# EasyEDA Pro project Charger.epro

# Schematic Schematic1
Board Name: Board1; Create Date: 2025-06-16; Page Name: P1; Project Name: SlimeVR / Charger; Schematic Name: Schematic1; Update Date: 2025-06-16; Company: EasyEDA.com; Page Size: A4; Version: V1.0
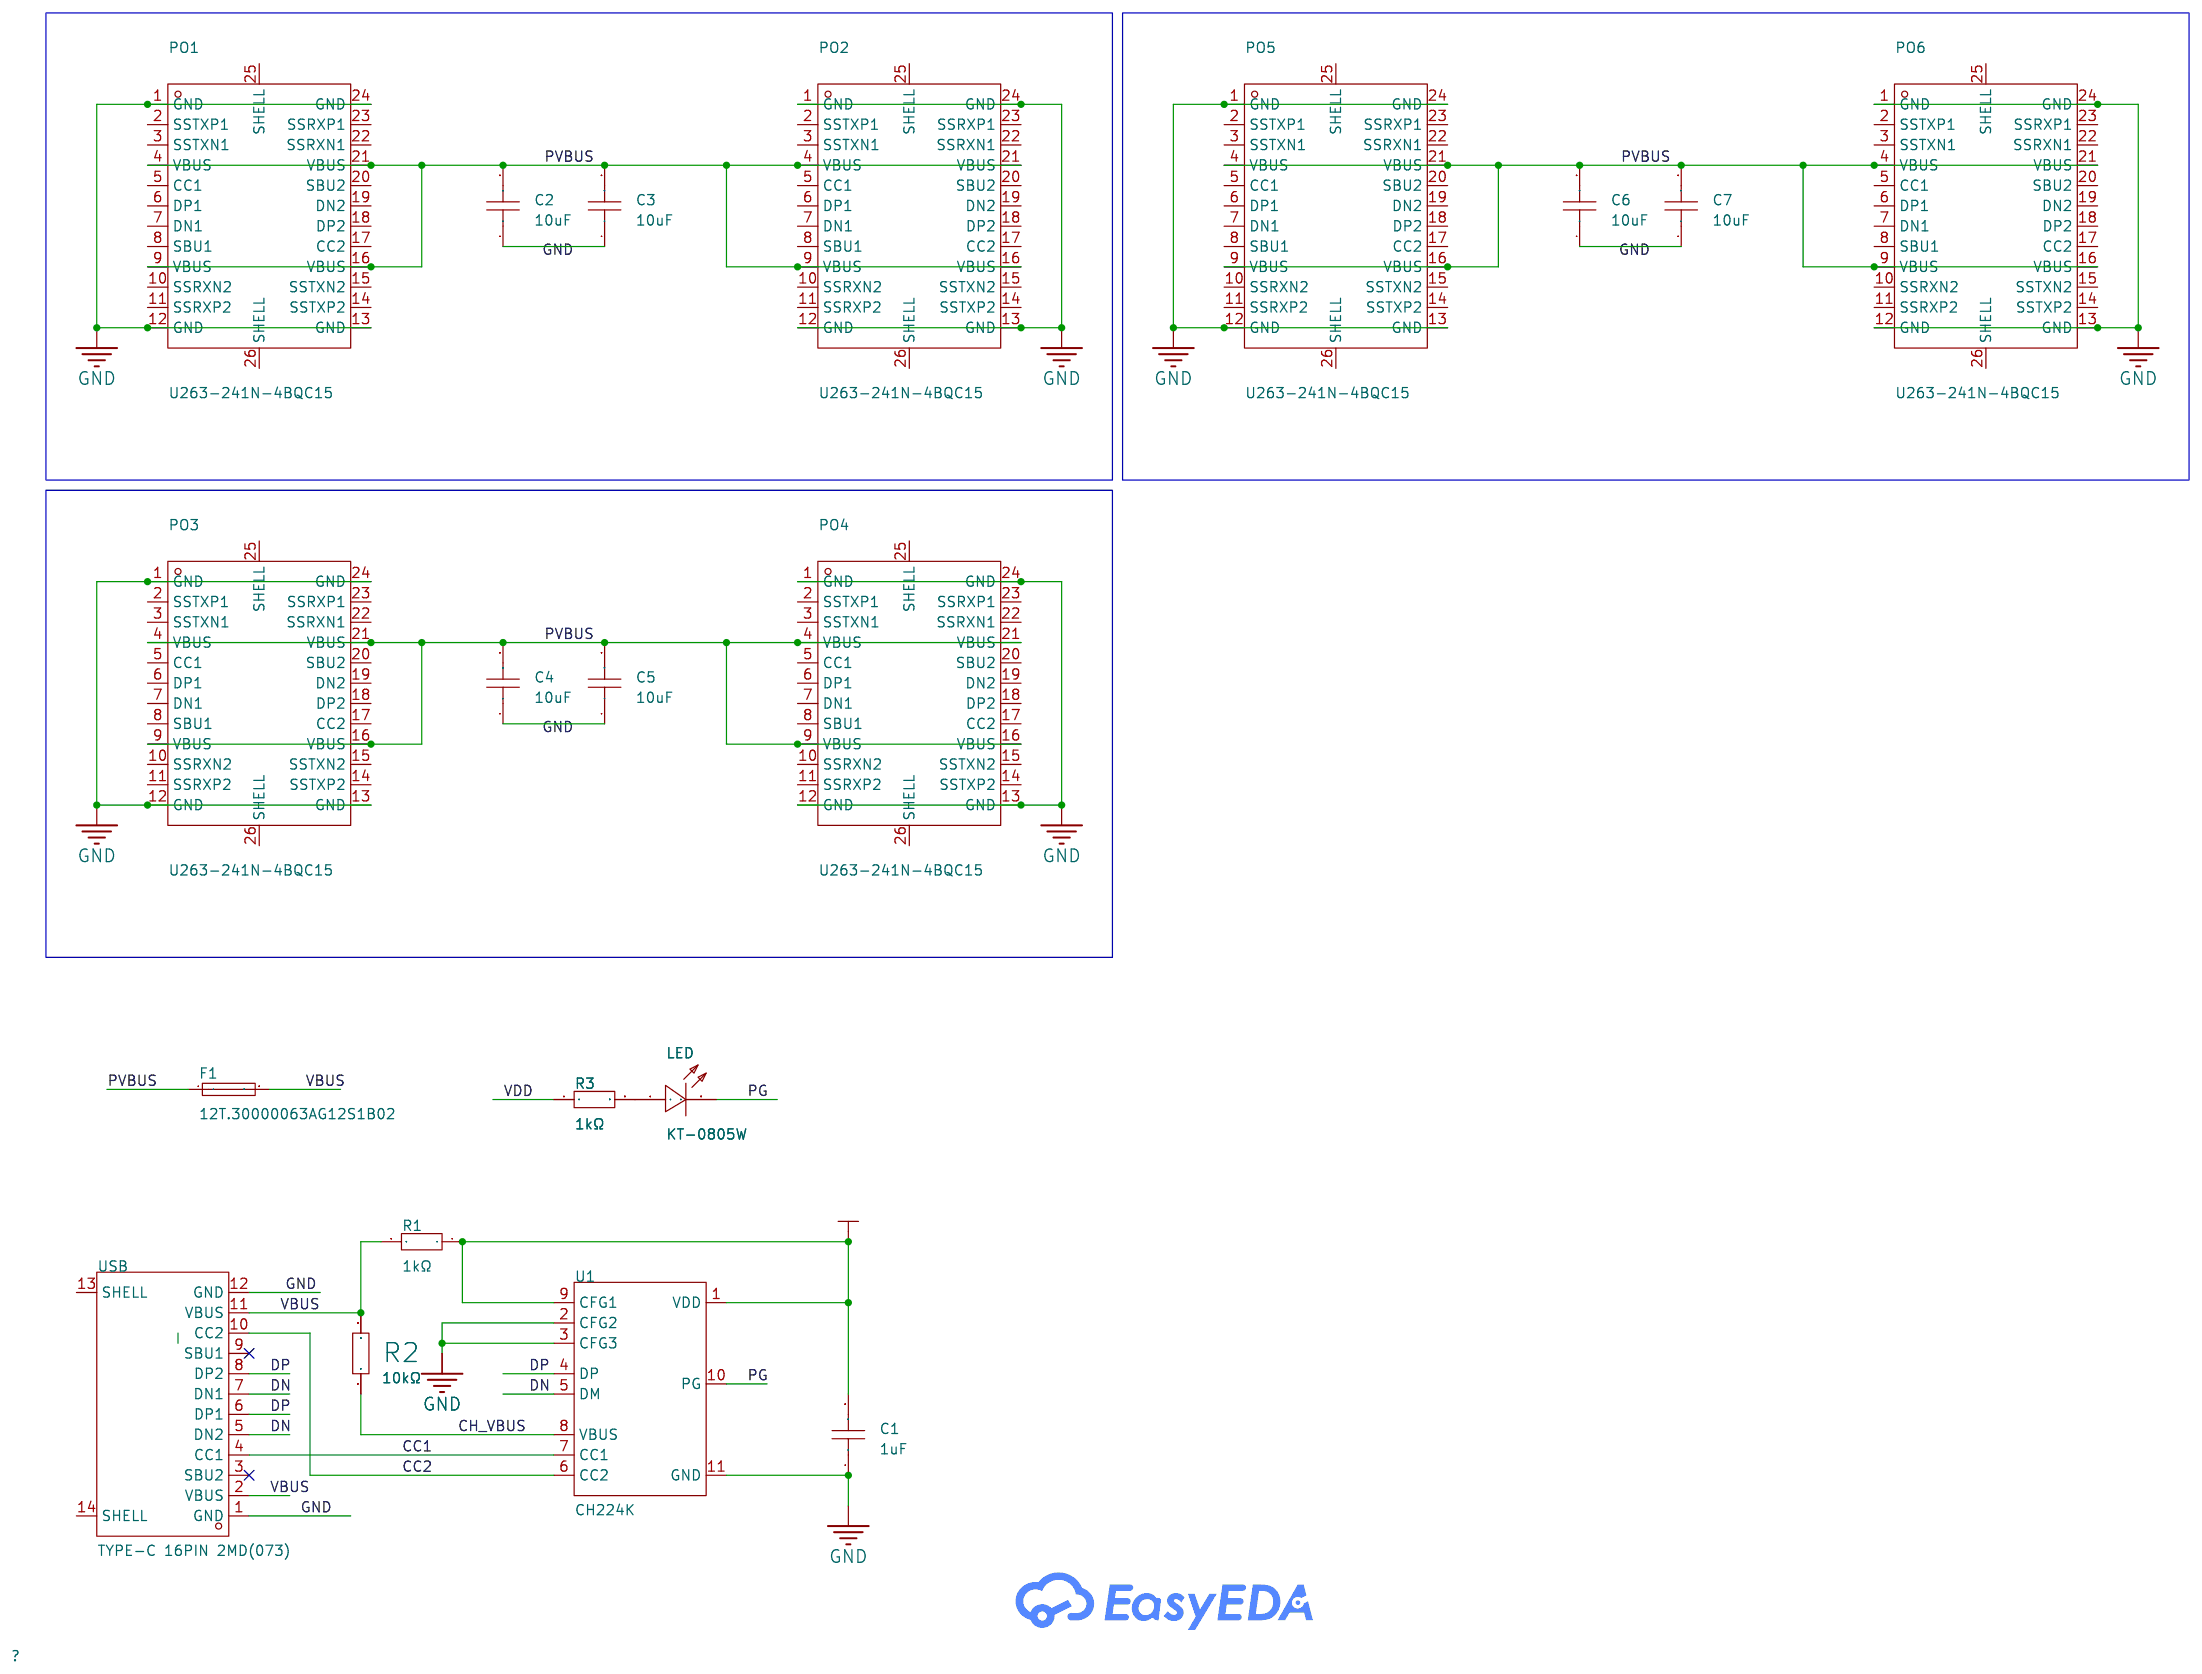
[diagram p0: schematic sheet]

## Parts
C1  1uF  [C0603]
C2  10uF  [C0805]
C3  10uF  [C0805]
C4  10uF  [C0805]
C5  10uF  [C0805]
C6  10uF  [C0805]
C7  10uF  [C0805]
F1  12T.30000063AG12S1B02  [F1206]
LED  KT-0805W  [LED0805-R-RD]
PO1  U263-241N-4BQC15  [USB-C-SMD_U263-241N-4BQC15]
PO2  U263-241N-4BQC15  [USB-C-SMD_U263-241N-4BQC15]
PO3  U263-241N-4BQC15  [USB-C-SMD_U263-241N-4BQC15]
PO4  U263-241N-4BQC15  [USB-C-SMD_U263-241N-4BQC15]
PO5  U263-241N-4BQC15  [USB-C-SMD_U263-241N-4BQC15]
PO6  U263-241N-4BQC15  [USB-C-SMD_U263-241N-4BQC15]
R1  1kΩ  [R0603]
R2  10kΩ  [R0603]
R3  1kΩ  [R0603]
U1  CH224K  [ESSOP-10_L4.9-W3.9-P1.0-LS6.0-TL-EP]
USB  TYPE-C 16PIN 2MD(073)  [USB-C-SMD_TYPE-C-6PIN-2MD-073]

## Library data of the parts
C1 = CL10A105KB8NNNC: Capacitance: Tolerance:±10% Tolerance:±10% Voltage Rated: Temperature Coefficient:; LCSC Part Name: 1uF ±10% 50V; Supplier Part: C15849; Manufacturer: SAMSUNG(三星); Supplier Footprint: 0603; JLCPCB Part Class: Basic Part; Datasheet: https://atta.szlcsc.com/upload/public/pdf/source/20160218/1457707763339.pdf; Supplier: LCSC; Tolerance: ±10%
C2-C7 = CL21A106KAYNNNE_C15850: Capacitance: Tolerance:±10% Tolerance:±10% Voltage Rated: Temperature Coefficient:; LCSC Part Name: 10uF ±10% 25V; Supplier Part: C15850; Manufacturer: SAMSUNG(三星); Manufacturer Part: CL21A106KAYNNNE; Supplier Footprint: 0805; JLCPCB Part Class: Basic Part; Datasheet: https://atta.szlcsc.com/upload/public/pdf/source/20160218/1457707763339.pdf; Supplier: LCSC; Tolerance: ±10%
F1 = 12T.30000063AG12S1B02: Type:SMD Fuse Current Rating:3A Voltage Rating (DC):63V Operating Temperature:-55℃~+125℃ Operating Temperature:-55℃~+125℃ Interrupt Rating:50A; LCSC Part Name: 贴片式保险丝; Supplier Part: C140478; Manufacturer: xcfuse(旭程); Supplier Footprint: 1206; JLCPCB Part Class: Extended Part; Datasheet: https://atta.szlcsc.com/upload/public/pdf/source/20180423/C140482_0BFCB1E2582598C0CD6C9793BBCA88DB.pdf; Supplier: LCSC; Type: SMD Fuse; Current Rating: 3A; Voltage Rating (DC): 63V; Operating Temperature: -55℃~+125℃; Interrupt Rating: 50A
LED = KT-0805W: LCSC Part Name: 0805 白灯 高亮; Supplier Part: C34499; Manufacturer: KENTO; Supplier Footprint: 0805; JLCPCB Part Class: Basic Part; Datasheet: https://atta.szlcsc.com/upload/public/pdf/source/20221124/DAA20402FFC1FB071B8B6797757426FE.pdf; Supplier: LCSC
PO1-PO6 = U263-241N-4BQC15: Connector Type:Type-C Standard:- Gender:Male Mounting Style:- Number of Contacts:24P Number of Ports:1 Current Rating - Power (Max):3A Contact Material:Copper alloy Contact Plating:Gold Operating Temperature Range:-30℃~+85℃ Operating Temperature Range:-30; LCSC Part Name: Type-C 公; Supplier Part: C2764604; Manufacturer: XKB Connection(中国星坤); Supplier Footprint: SMD; JLCPCB Part Class: Extended Part; Datasheet: https://atta.szlcsc.com/upload/public/pdf/source/20211011/8F46773D4A429D5B7D6EF8AD2F8FE85B.pdf; Supplier: LCSC; Connector Type: Type-C; Gender: Male; Number of Contacts: 24P; Number of Ports: 1; Current Rating - Power (Max): 3A; Contact Material: Copper alloy; Contact Plating: Gold; Operating Temperature Range: -30℃~+85℃; Soldering Temperature(Max): 260℃
R1 R3 = 0603WAF1001T5E: Type:Thick Film Resistors Resistance:1kΩ Tolerance:±1% Tolerance:±1% Power(Watts): Overload Voltage (Max): Temperature Coefficient:±100ppm/℃ Temperature Coefficient:±100ppm/℃ Operating Temperature Range:-55℃~+155℃ Operating Temperature Range:-55℃~+155℃; LCSC Part Name: 1kΩ ±1% 100mW 厚膜电阻; Supplier Part: C21190; Manufacturer: UNI-ROYAL(厚声); Supplier Footprint: 0603; JLCPCB Part Class: Basic Part; Datasheet: https://atta.szlcsc.com/upload/public/pdf/source/20200306/C422600_1E6D84923E4A46A82E41ADD87F860B5C.pdf; Supplier: LCSC; Type: Thick Film Resistors; Tolerance: ±1%; Temperature Coefficient: ±100ppm/℃; Operating Temperature Range: -55℃~+155℃
R2 = 0603WAF1002T5E: Type:Thick Film Resistors Resistance:10kΩ Tolerance:±1% Tolerance:±1% Power(Watts): Overload Voltage (Max): Temperature Coefficient:±100ppm/℃ Temperature Coefficient:±100ppm/℃ Operating Temperature Range:-55℃~+155℃ Operating Temperature Range:-55℃~+155℃; LCSC Part Name: 厚膜电阻 10kΩ ±1% 100mW; Supplier Part: C25804; Manufacturer: UNI-ROYAL(厚声); Supplier Footprint: 0603; JLCPCB Part Class: Basic Part; Datasheet: https://atta.szlcsc.com/upload/public/pdf/source/20200306/C422600_1E6D84923E4A46A82E41ADD87F860B5C.pdf; Supplier: LCSC; Type: Thick Film Resistors; Tolerance: ±1%; Temperature Coefficient: ±100ppm/℃; Operating Temperature Range: -55℃~+155℃
U1 = CH224K: LCSC Part Name: USBPD等多快充协议受电芯片CH224; Supplier Part: C970725; Manufacturer: WCH(南京沁恒); Supplier Footprint: ESSOP-10-150mil-1mm; JLCPCB Part Class: Extended Part; Datasheet: https://atta.szlcsc.com/upload/public/pdf/source/20240313/43C2AFDDBDD1F65B60386D2CCAB0811B.pdf; Supplier: LCSC
USB = TYPE-C 16PIN 2MD(073): Connector Type:Type-C Standard:USB 3.1 Gender:Female Mounting Style:Horizontal attachment Number of Contacts:16P Number of Ports:1 Current Rating - Power (Max):5A Operating Temperature Range:-25℃~+85℃ Operating Temperature Range:-25℃~+85℃ Rated Voltage (M; LCSC Part Name: Type-C 母 卧贴; Supplier Part: C2765186; Manufacturer: SHOU HAN(首韩); Supplier Footprint: SMD; JLCPCB Part Class: Extended Part; Datasheet: https://atta.szlcsc.com/upload/public/pdf/source/20211123/39B17C16241EAC15C5E277BDA434118E.pdf; Supplier: LCSC; Connector Type: Type-C; Standard: USB 3.1; Gender: Female; Mounting Style: Horizontal attachment; Number of Contacts: 16P; Number of Ports: 1; Current Rating - Power (Max): 5A; Operating Temperature Range: -25℃~+85℃; Rated Voltage (Max): 5V; Connect-Disconnect Life: 5000 Cuts; Core Colour: Black

## Nets
GND: C1.1 C2.1 C3.1 C4.1 C5.1 C6.1 C7.1 PO1.1(GND) PO1.12(GND) PO1.13(GND) PO1.24(GND) PO2.1(GND) PO2.12(GND) PO2.13(GND) PO2.24(GND) PO3.1(GND) PO3.12(GND) PO3.13(GND) PO3.24(GND) PO4.1(GND) PO4.12(GND) PO4.13(GND) PO4.24(GND) PO5.1(GND) PO5.12(GND) PO5.13(GND) PO5.24(GND) PO6.1(GND) PO6.12(GND) PO6.13(GND) PO6.24(GND) U1.2(CFG2) U1.3(CFG3) U1.11(GND) USB.1(GND) USB.12(GND)
PVBUS: C2.2 C3.2 C4.2 C5.2 C6.2 C7.2 F1.1 PO1.4(VBUS) PO1.9(VBUS) PO1.16(VBUS) PO1.21(VBUS) PO2.4(VBUS) PO2.9(VBUS) PO2.16(VBUS) PO2.21(VBUS) PO3.4(VBUS) PO3.9(VBUS) PO3.16(VBUS) PO3.21(VBUS) PO4.4(VBUS) PO4.9(VBUS) PO4.16(VBUS) PO4.21(VBUS) PO5.4(VBUS) PO5.9(VBUS) PO5.16(VBUS) PO5.21(VBUS) PO6.4(VBUS) PO6.9(VBUS) PO6.16(VBUS) PO6.21(VBUS)
VBUS: F1.2 R1.2 R2.2 USB.2(VBUS) USB.11(VBUS)
VDD: C1.2 R1.1 R3.1 U1.1(VDD) U1.9(CFG1)
CC1: U1.7(CC1) USB.4(CC1)
CC2: U1.6(CC2) USB.10(CC2)
CH_VBUS: R2.1 U1.8(VBUS)
DN: U1.5(DM) USB.5(DN2) USB.7(DN1)
DP: U1.4(DP) USB.6(DP1) USB.8(DP2)
PG: LED.2(K) U1.10(PG)
$1N1647: LED.1(A) R3.2

Not connected (* = marked no-connect by the designer): PO1 2(SSTXP1) 3(SSTXN1) 5(CC1) 6(DP1) 7(DN1) 8(SBU1) 10(SSRXN2) 11(SSRXP2) 14(SSTXP2) 15(SSTXN2) 17(CC2) 18(DP2) 19(DN2) 20(SBU2) 22(SSRXN1) 23(SSRXP1) 25(SHELL) 26(SHELL); PO2 2(SSTXP1) 3(SSTXN1) 5(CC1) 6(DP1) 7(DN1) 8(SBU1) 10(SSRXN2) 11(SSRXP2) 14(SSTXP2) 15(SSTXN2) 17(CC2) 18(DP2) 19(DN2) 20(SBU2) 22(SSRXN1) 23(SSRXP1) 25(SHELL) 26(SHELL); PO3 2(SSTXP1) 3(SSTXN1) 5(CC1) 6(DP1) 7(DN1) 8(SBU1) 10(SSRXN2) 11(SSRXP2) 14(SSTXP2) 15(SSTXN2) 17(CC2) 18(DP2) 19(DN2) 20(SBU2) 22(SSRXN1) 23(SSRXP1) 25(SHELL) 26(SHELL); PO4 2(SSTXP1) 3(SSTXN1) 5(CC1) 6(DP1) 7(DN1) 8(SBU1) 10(SSRXN2) 11(SSRXP2) 14(SSTXP2) 15(SSTXN2) 17(CC2) 18(DP2) 19(DN2) 20(SBU2) 22(SSRXN1) 23(SSRXP1) 25(SHELL) 26(SHELL); PO5 2(SSTXP1) 3(SSTXN1) 5(CC1) 6(DP1) 7(DN1) 8(SBU1) 10(SSRXN2) 11(SSRXP2) 14(SSTXP2) 15(SSTXN2) 17(CC2) 18(DP2) 19(DN2) 20(SBU2) 22(SSRXN1) 23(SSRXP1) 25(SHELL) 26(SHELL); PO6 2(SSTXP1) 3(SSTXN1) 5(CC1) 6(DP1) 7(DN1) 8(SBU1) 10(SSRXN2) 11(SSRXP2) 14(SSTXP2) 15(SSTXN2) 17(CC2) 18(DP2) 19(DN2) 20(SBU2) 22(SSRXN1) 23(SSRXP1) 25(SHELL) 26(SHELL); USB 3(SBU2)* 9(SBU1)* 13(SHELL) 14(SHELL)

# Board PCB1
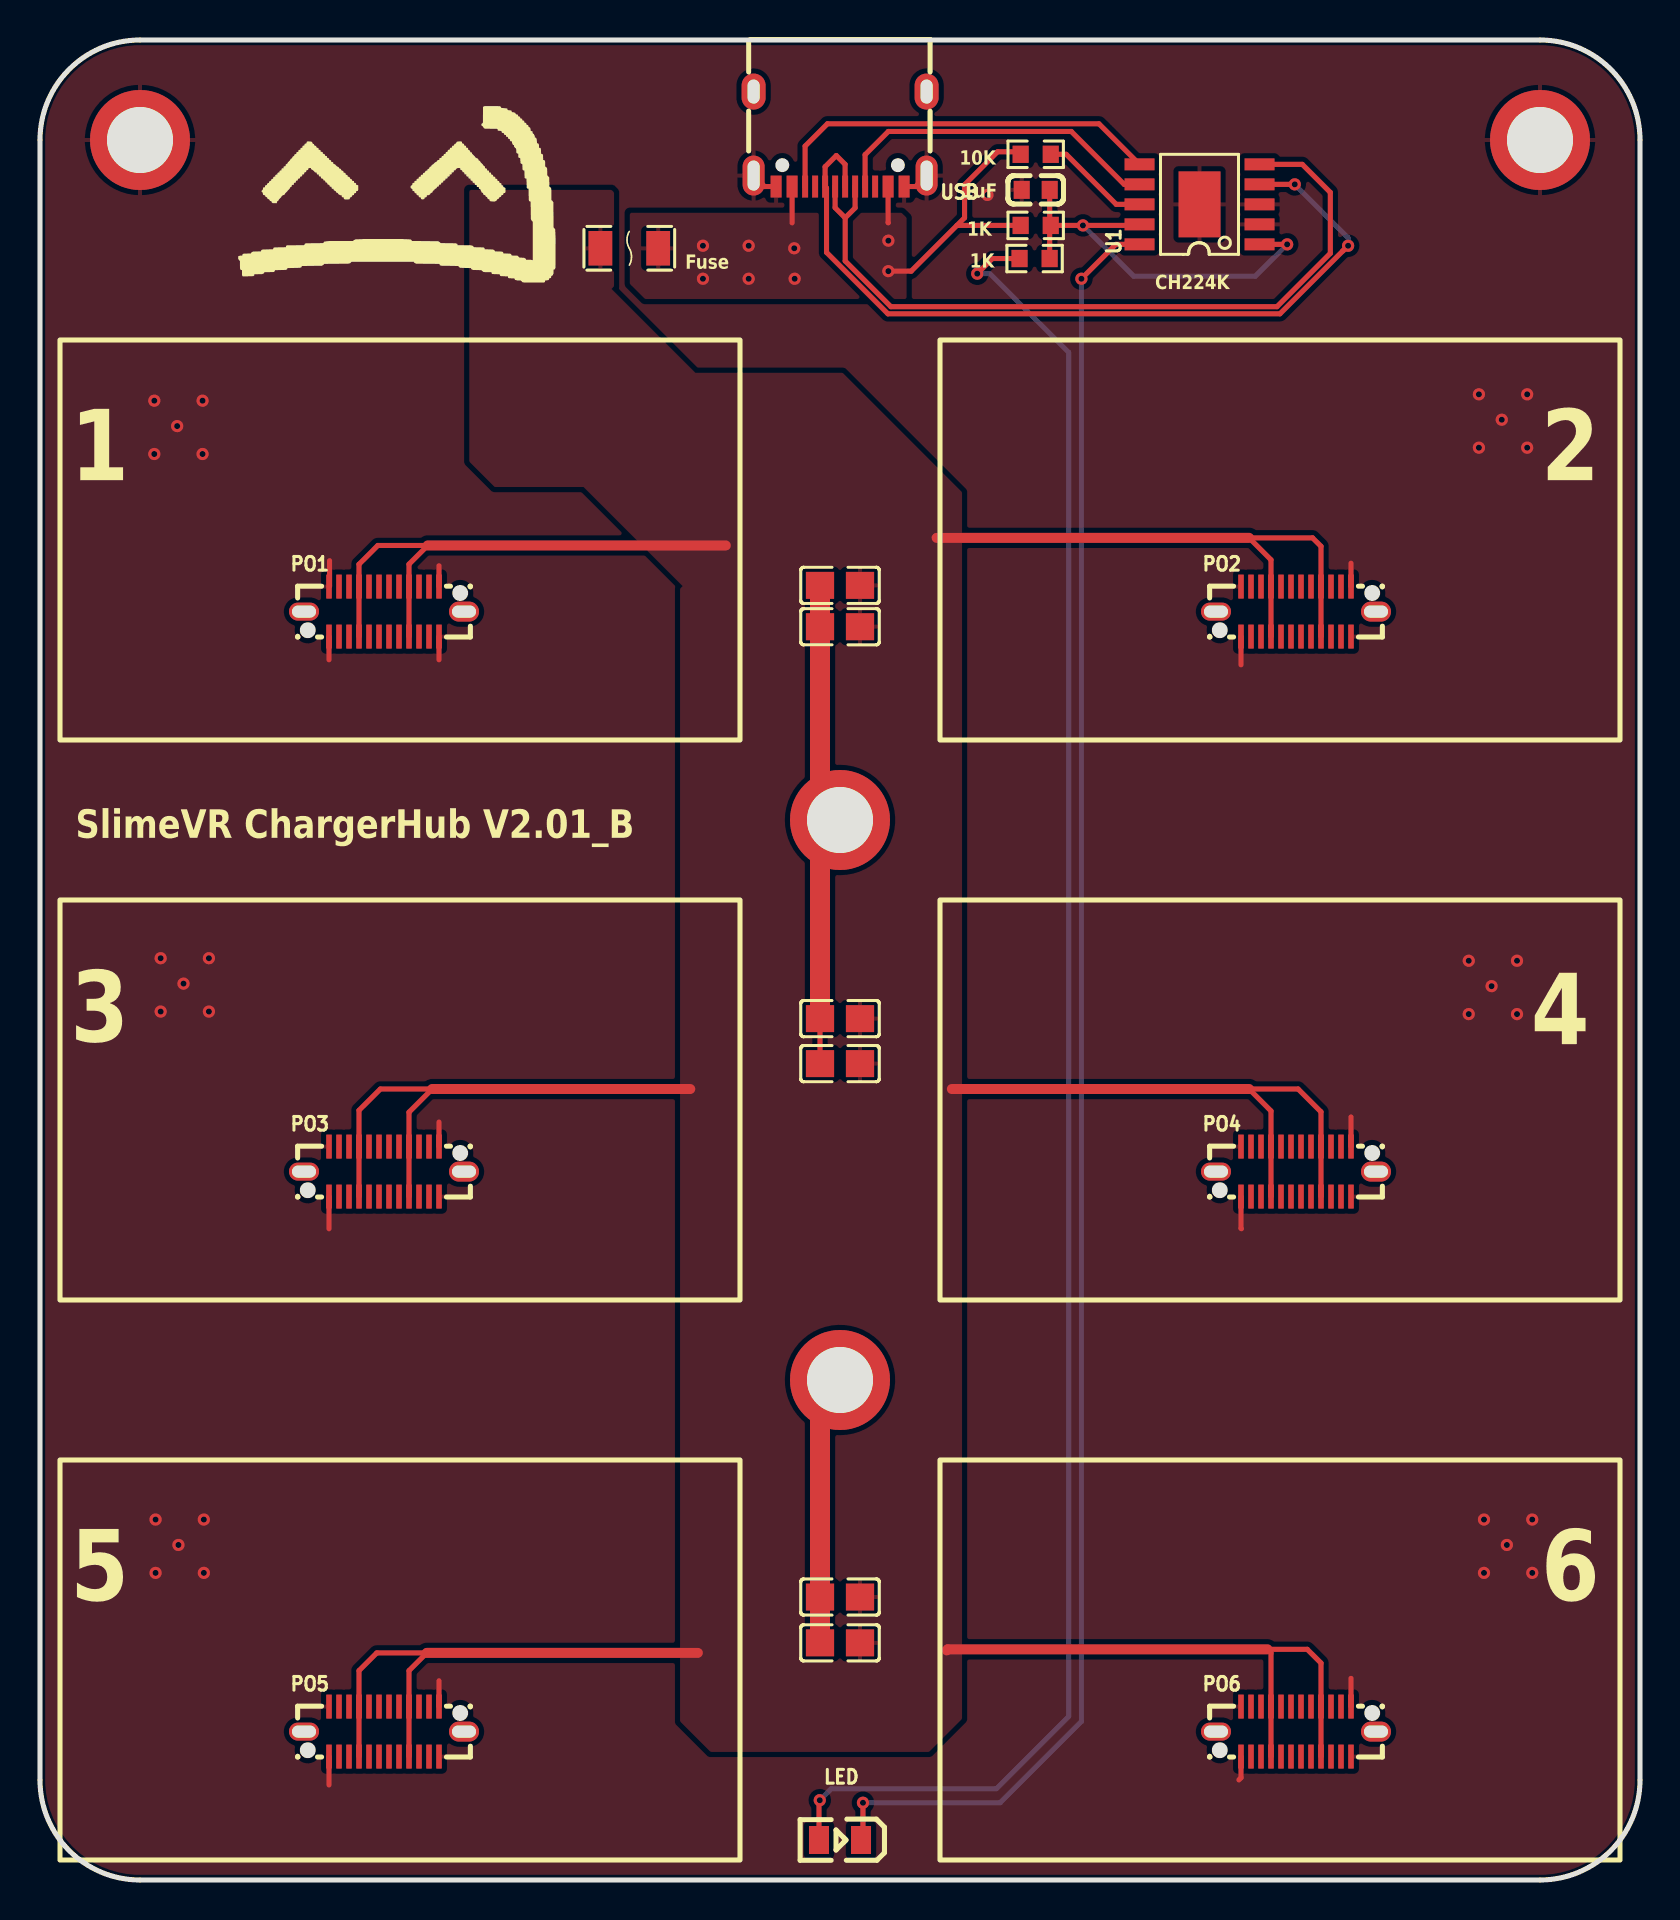
[diagram p1: board, top side]
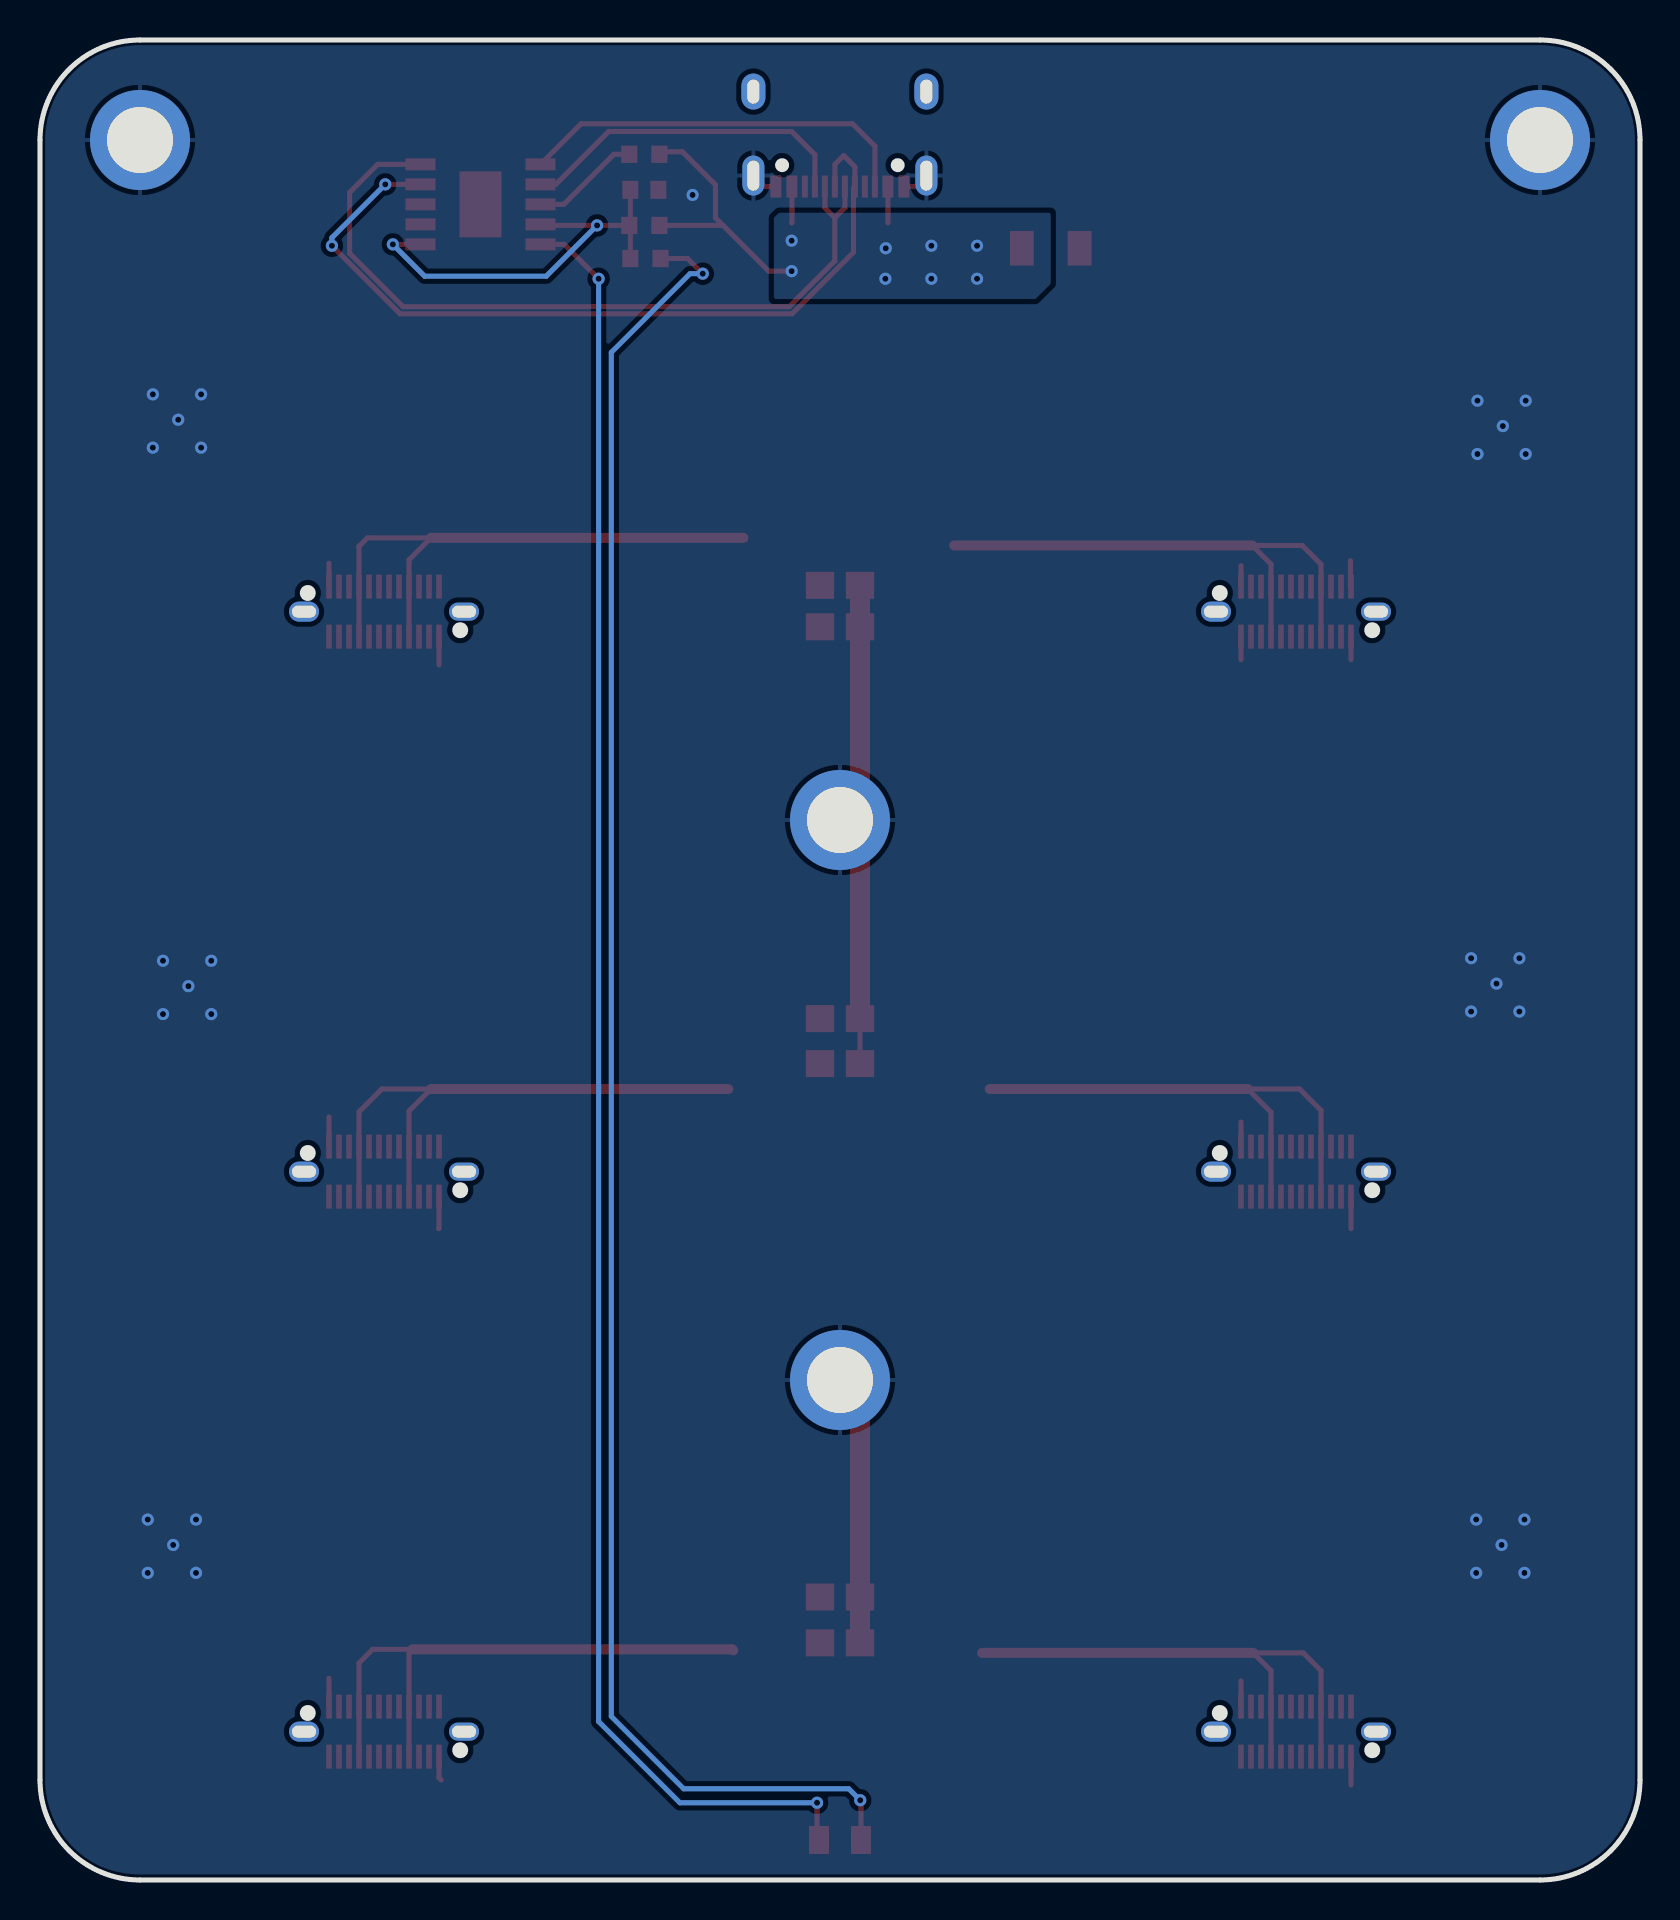
[diagram p2: board, bottom side, seen from below]

Outline 80 x 92 mm; copper layers: Top Layer, Bottom Layer. Coordinates in mm from the lower left corner of the outline.
Outline path: 0,87 0,5 arc(1.46,1.46) 5,0 75,0 arc(78.54,1.46) 80,5 80,87 arc(78.54,90.54) 75,92 5,92 arc(1.46,90.54) 0,87
Stack: Top Layer 0.035mm / Dielectric1 1.51mm FR4 er 4.5 / Bottom Layer 0.035mm

## Design rules (mm)
template: JLCPCB Capability(Two Layers Board)
spacing copperThickness1oz (default): track to track 0.102, other pairs 0.152 to 0.3
spacing copperThickness2oz: track to track 0.203, other pairs 0.152 to 0.3
track width copperThickness1oz (default): min 0.127, default 0.254, max 2.54
track width copperThickness2oz: min 0.203, default 0.254, max 2.54
differential pair differentialPair (default): width min 0.127, default 0.254, max 2.54; gap min 0.152, default 0.152
via viaSize (default): diameter min 0.5, default 0.61, max 10; hole min 0.3, default 0.305, max 6.3

## Placement (name value [footprint] x y rotation side)
C1  1uF  [C0603]  49.78 84.51 0 top
C2  10uF  [C0805]  40 64.73 0 top
C3  10uF  [C0805]  40 62.66 0 top
C4  10uF  [C0805]  40 40.82 0 top
C5  10uF  [C0805]  40 43.07 0 top
C6  10uF  [C0805]  40 14.15 0 top
C7  10uF  [C0805]  40 11.86 0 top
F1  12T.30000063AG12S1B02  [F1206]  29.46 81.59 0 top
LED  KT-0805W  [LED0805-R-RD]  40 2 180 top
NOREF  -  [Pad_e818]  5 87 0 top
NOREF#2  -  [Pad_e816]  75 87 0 top
NOREF#3  -  [Pad_e821]  40 25 0 top
NOREF#4  -  [Pad_e822]  40 53 0 top
PO1  U263-241N-4BQC15  [USB-C-SMD_U263-241N-4BQC15]  17.2 63.42 0 top
PO2  U263-241N-4BQC15  [USB-C-SMD_U263-241N-4BQC15]  62.8 63.42 0 top
PO3  U263-241N-4BQC15  [USB-C-SMD_U263-241N-4BQC15]  17.2 35.42 0 top
PO4  U263-241N-4BQC15  [USB-C-SMD_U263-241N-4BQC15]  62.8 35.42 0 top
PO5  U263-241N-4BQC15  [USB-C-SMD_U263-241N-4BQC15]  17.2 7.42 0 top
PO6  U263-241N-4BQC15  [USB-C-SMD_U263-241N-4BQC15]  62.8 7.42 0 top
R1  1kΩ  [R0603]  49.78 82.73 180 top
R2  10kΩ  [R0603]  49.78 86.28 180 top
R3  1kΩ  [R0603]  49.73 81.07 180 top
U1  CH224K  [ESSOP-10_L4.9-W3.9-P1.0-LS6.0-TL-EP]  57.98 83.78 90 top
USB  TYPE-C 16PIN 2MD(073)  [USB-C-SMD_TYPE-C-6PIN-2MD-073]  40 87.05 180 top

## Footprints (pads in the part's own frame, mm; a bottom-side part is the same pattern mirrored in y, then rotated)
C0603
  rect 0.8x0.9 smd: 1(-0.7,0) 2(0.7,0)
C0805
  rect 1.41x1.35 smd: 1(-1,0) 2(1,0)
ESSOP-10_L4.9-W3.9-P1.0-LS6.0-TL-EP
  rect 0.6x1.5 smd: 1(-2,-3) 2(-1,-3) 3(0,-3) 4(1,-3) 5(2,-3) 6(2,3) 7(1,3) 8(0,3) 9(-1,3) 10(-2,3)
  rect 3.3x2.1 smd: 11(0,0)
F1206
  rect 1.19x1.728 smd: 1(-1.445,0) 2(1.445,0)
LED0805-R-RD
  rect 1x1.399 smd: 1(1.05,0) 2(-1.05,0)
Pad_e816
  round 5 hole 3.3: 1(0,0)
Pad_e818
  round 5 hole 3.3: 1(0,0)
Pad_e821
  round 5 hole 3.3: 1(0,0)
Pad_e822
  round 5 hole 3.3: 1(0,0)
R0603
  rect 0.806x0.864 smd: 1(-0.753,0) 2(0.753,0)
USB-C-SMD_TYPE-C-6PIN-2MD-073
  rect 0.55x1.1 smd: 1(-3.2,2.375) 2(-2.4,2.375) 11(2.4,2.375) 12(3.2,2.375)
  rect 0.3x1.1 smd: 3(-1.75,2.375) 4(-1.25,2.375) 5(-0.75,2.375) 6(-0.25,2.375) 7(0.25,2.375) 8(0.75,2.375) 9(1.25,2.375) 10(1.75,2.375)
  oval 1.1x2 hole 0.6x1.5: 13(-4.325,1.825) 14(4.325,1.825)
  oval 1.2x1.8 hole 0.6x1.2: 13(-4.325,-2.375) 14(4.325,-2.375)
USB-C-SMD_U263-241N-4BQC15
  rect 0.28x1.2 smd: 1(2.75,1.25) 2(2.25,1.25) 3(1.75,1.25) 4(1.25,1.25) 5(0.75,1.25) 6(0.25,1.25) 7(-0.25,1.25) 8(-0.75,1.25) 9(-1.25,1.25) 10(-1.75,1.25) 11(-2.25,1.25) 12(-2.75,1.25) 13(-2.75,-1.25) 14(-2.25,-1.25) 15(-1.75,-1.25) 16(-1.25,-1.25) 17(-0.75,-1.25) 18(-0.25,-1.25) 19(0.25,-1.25) 20(0.75,-1.25) 21(1.25,-1.25) 22(1.75,-1.25) 23(2.25,-1.25) 24(2.75,-1.25)
  oval 1.5x1 hole 1.2x0.6: 25(4,0)
  oval 1.5x0.9 hole 1.2x0.6: 26(-4,0)

## Nets
As in the schematic, except:
GND: C1.1 C2.1 C3.1 C4.1 C5.1 C6.1 C7.1 NOREF.1 NOREF#2.1 NOREF#3.1 NOREF#4.1 PO1.1 PO1.12 PO1.13 PO1.24 PO2.1 PO2.12 PO2.13 PO2.24 PO3.1 PO3.12 PO3.13 PO3.24 PO4.1 PO4.12 PO4.13 PO4.24 PO5.1 PO5.12 PO5.13 PO5.24 PO6.1 PO6.12 PO6.13 PO6.24 U1.2 U1.3 U1.11 USB.1 USB.12

Pads without a net: PO1 2 3 5 6 7 8 10 11 14 15 17 18 19 20 22 23 25 26; PO2 2 3 5 6 7 8 10 11 14 15 17 18 19 20 22 23 25 26; PO3 2 3 5 6 7 8 10 11 14 15 17 18 19 20 22 23 25 26; PO4 2 3 5 6 7 8 10 11 14 15 17 18 19 20 22 23 25 26; PO5 2 3 5 6 7 8 10 11 14 15 17 18 19 20 22 23 25 26; PO6 2 3 5 6 7 8 10 11 14 15 17 18 19 20 22 23 25 26; USB 3 9 13 14

## Via types
v1: diameter 0.61, hole 0.305, Top Layer to Bottom Layer, 47 vias

## Routing (per net, layer and track width the routed paths; a pad name or vN(x,y) marks a point on that pad's centre or on a via; arc(x,y) is an arc through that point)
GND: length 59.5
  Top Layer w0.254: 59.94,5 60.05,5.11 PO6.13 ; 60.07,32.56 60.05,32.58 PO4.13 ; PO5.1 19.95,9.96 ; 35.68,85.22 36.23,84.67 USB.12 ; PO3.1 19.95,37.9 ; PO2.13 60.05,60.76 ; PO3.13 14.45,32.56 ; PO1.1 19.95,65.71 ; PO4.1 65.55,38.15 ; 44.33,85.22 43.78,84.67 USB.1 ; C4.1 C5.1 ; PO2.1 65.55,65.84 ; PO6.1 65.55,10.09 ; PO1.13 14.45,61.01 ; 14.48,65.97 14.48,64.7 PO1.12 ; PO1.24 19.95,61.01 ; PO5.13 14.45,4.75
  Top Layer w1: C5.1 39,52 NOREF#4.1 39,54 C3.1 C2.1 ; NOREF#3.1 39,24 C6.1 C7.1
  vias: v1(5.72,73.97) v1(5.72,71.3) v1(5.78,18.02) v1(5.78,15.36) v1(6.03,46.09) v1(6.03,43.42) v1(6.86,72.7) v1(6.92,16.75) v1(7.18,44.82) v1(8.13,73.97) v1(8.13,71.3) v1(8.19,18.02) v1(8.19,15.36) v1(8.45,46.09) v1(8.45,43.42) v1(47.37,84.25) v1(71.44,45.96) v1(71.44,43.3) v1(71.95,74.28) v1(71.95,71.62) v1(72.2,18.02) v1(72.2,15.36) v1(72.58,44.69) v1(73.09,73.01) v1(73.34,16.75) v1(73.85,45.96) v1(73.85,43.3) v1(74.36,74.28) v1(74.36,71.62) v1(74.61,18.02) v1(74.61,15.36)
PVBUS: length 169.1
  Top Layer w0.254: PO4.21 PO4.4 64.05,38.41 62.91,39.55 60.45,39.55 61.55,38.45 PO4.9 PO4.16 ; PO5.21 PO5.4 18.45,10.47 19.34,11.35 16.84,11.35 15.95,10.47 PO5.9 PO5.16 ; PO6.21 PO6.4 64.05,10.85 63.36,11.53 61.37,11.53 61.55,11.35 PO6.9 PO6.16 ; PO1.21 PO1.4 18.45,65.79 19.39,66.73 16.89,66.73 15.95,65.79 PO1.9 PO1.16 ; PO3.21 PO3.4 18.45,38.39 19.61,39.55 17.02,39.55 15.95,38.48 PO3.9 PO3.16 ; PO2.21 PO2.4 64.05,66.69 63.63,67.11 60.45,67.11 61.55,66.01 PO2.9 PO2.16
  Top Layer w0.5: 45.34,11.48 45.39,11.53 61.37,11.53 ; 19.61,39.55 32.51,39.55 ; 19.39,66.73 34.29,66.73 ; 19.34,11.35 32.89,11.35 ; 60.45,39.55 45.59,39.55 ; 60.45,67.11 44.83,67.11
VBUS: length 16.9
  Top Layer w0.254: v1(42.42,80.44) 43.56,80.44 45.85,82.73 ; R2.2 48.9,86.41 47.88,86.41 46.23,84.76 46.23,83.11 45.85,82.73 ; 45.85,82.73 R1.2 ; 42.42,82.86 42.41,82.87 USB.2 ; USB.11 37.6,82.86
  vias: v1(33.15,81.71) v1(33.15,80.06) v1(35.43,81.71) v1(35.43,80.06) v1(37.71,81.59) v1(37.73,80.06) v1(42.42,81.97)
VDD: length 21.2
  Top Layer w0.254: U1.1 v1(62.36,81.78) ; R1.1 v1(52.15,82.73) 54.92,82.73 U1.9 ; 50.48,81.07 C1.2
  Bottom Layer w0.254: v1(62.36,81.78) 60.76,80.19 54.69,80.19 v1(52.15,82.73)
CC1: length 16.9
  Top Layer w0.254: USB.4 41.25,86.27 42.42,87.43 51.56,87.43 54.21,84.78 U1.7
CC2: length 20
  Top Layer w0.254: USB.10 38.25,86.69 39.37,87.81 52.95,87.81 U1.6
CH_VBUS: length 5.5
  Top Layer w0.254: U1.8 53.81,83.78 51.31,86.28 R2.1
DN: length 39.2
  Top Layer w0.254: 40.26,83.11 39.75,83.61 USB.7 ; 40.26,83.11 40.26,80.95 42.54,78.67 61.85,78.67 64.52,81.33 64.52,84.38 63.11,85.78 U1.5 ; 40.26,83.11 40.75,83.61 USB.5
DP: length 41.5
  Top Layer w0.254: v1(65.41,81.71) 65.15,81.46 65.15,81.46 62,78.31 42.4,78.31 39.33,81.38 39.33,84.6 USB.8 39.25,85.66 39.81,86.22 40.25,85.78 USB.6 ; U1.4 v1(62.74,84.78)
  Bottom Layer w0.254: v1(62.74,84.78) 65.41,82.11 v1(65.41,81.71)
PG: length 90.3
  Top Layer w0.254: U1.10 53.79,81.78 v1(52.07,80.06) ; v1(41.15,3.86) 41.15,2.1 LED.2
  Bottom Layer w0.254: v1(41.15,3.86) 48.01,3.86 52.07,7.93 v1(52.07,80.06)
$1N1647: length 93
  Top Layer w0.254: v1(38.99,3.99) 38.95,3.95 LED.1 ; R3.2 47.62,81.07 v1(46.86,80.32)
  Bottom Layer w0.254: v1(38.99,3.99) 39.56,4.56 47.82,4.56 51.44,8.18 51.44,76.38 47.5,80.32 v1(46.86,80.32)

## Copper pours and planes (outline as drawn; the poured copper is in the pictures)
GND on Top Layer: 0,87.03 0.02,87.36 0.07,87.81 0.16,88.25 0.29,88.68 0.45,89.09 0.66,89.49 0.89,89.87 1.17,90.23 1.47,90.56 1.8,90.86 2.16,91.14 2.54,91.37 2.94,91.58 3.35,91.75 3.78,91.87 4.22,91.96 4.67,92.01 5,92.03 75,92.03 75.34,92.01 75.79,91.96 76.23,91.87 76.66,91.75 77.07,91.58 77.47,91.37 77.85,91.14 78.21,90.86 78.54,90.56 78.84,90.23 79.12,89.87 79.35,89.49 79.56,89.09 79.72,88.68 79.85,88.25 79.94,87.81 79.99,87.36 80,87.03 80,5.03 79.99,4.69 79.94,4.24 79.85,3.8 79.72,3.37 79.56,2.96 79.35,2.56 79.12,2.18 78.84,1.82 78.54,1.49 78.21,1.19 77.85,0.92 77.47,0.68 77.07,0.47 76.66,0.31 76.23,0.18 75.79,0.09 75.34,0.04 75,0.03 5,0.03 4.67,0.04 4.22,0.09 3.78,0.18 3.35,0.31 2.94,0.47 2.54,0.68 2.16,0.92 1.8,1.19 1.47,1.49 1.17,1.82 0.89,2.18 0.66,2.56 0.45,2.96 0.29,3.37 0.16,3.8 0.07,4.24 0.02,4.69 0,5.03
GND on Bottom Layer: 0,87.28 0.02,87.62 0.07,88.06 0.16,88.5 0.29,88.93 0.45,89.35 0.66,89.75 0.89,90.13 1.17,90.48 1.47,90.82 1.8,91.12 2.16,91.39 2.54,91.63 2.94,91.83 3.35,92 3.78,92.13 4.22,92.22 4.67,92.27 5,92.28 75,92.28 75.34,92.27 75.79,92.22 76.23,92.13 76.66,92 77.07,91.83 77.47,91.63 77.85,91.39 78.21,91.12 78.54,90.82 78.84,90.48 79.12,90.13 79.35,89.75 79.56,89.35 79.72,88.93 79.85,88.5 79.94,88.06 79.99,87.62 80,87.28 80,5.28 79.99,4.94 79.94,4.5 79.85,4.06 79.72,3.63 79.56,3.21 79.35,2.81 79.12,2.43 78.84,2.08 78.54,1.74 78.21,1.44 77.85,1.17 77.47,0.93 77.07,0.73 76.66,0.56 76.23,0.43 75.79,0.34 75.34,0.29 75,0.28 5,0.28 4.67,0.29 4.22,0.34 3.78,0.43 3.35,0.56 2.94,0.73 2.54,0.93 2.16,1.17 1.8,1.44 1.47,1.74 1.17,2.08 0.89,2.43 0.66,2.81 0.45,3.21 0.29,3.63 0.16,4.06 0.07,4.5 0.02,4.94 0,5.28
PVBUS on Top Layer: 21.46,84.51 28.57,84.51 28.7,84.38 28.7,79.68 28.57,79.55 32.77,75.36 40.13,75.36 46.1,69.39 46.1,8.05 44.45,6.4 33.53,6.4 32,7.93 32,64.57 32.13,64.69 27.18,69.65 22.73,69.65 21.46,70.92
VBUS on Top Layer: 29.49,83.36 29.49,79.81 30.25,79.05 43.33,79.05 43.33,83.11 43.08,83.36
VBUS on Bottom Layer: 29.46,83.36 29.46,79.81 30.23,79.05 43.31,79.05 43.31,83.11 43.05,83.36

## Text on the board
Top Silkscreen Layer: Fuse | 10K | 1uF | 1K | CH224K | SlimeVR ChargerHub V2.01_B | 1 | 3 | 5 | 4 | 2 | 6
